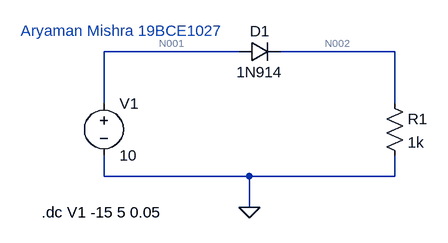
[diagram p0: schematic 2 Diode Characteristics.asc]
2 Diode Characteristics.asc, the LTspice schematic file:
Version 4
SHEET 1 880 680
WIRE 256 48 48 48
WIRE 496 48 320 48
WIRE 48 128 48 48
WIRE 496 128 496 48
WIRE 48 240 48 208
WIRE 272 240 48 240
WIRE 496 240 496 208
WIRE 496 240 272 240
WIRE 272 288 272 240
FLAG 272 288 0
SYMBOL voltage 48 112 R0
WINDOW 123 0 0 Left 0
WINDOW 39 0 0 Left 0
SYMATTR InstName V1
SYMATTR Value 10
SYMBOL diode 256 64 R270
WINDOW 0 32 32 VTop 2
WINDOW 3 0 32 VBottom 2
SYMATTR InstName D1
SYMATTR Value 1N914
SYMBOL res 480 112 R0
SYMATTR InstName R1
SYMATTR Value 1k
TEXT -48 296 Left 2 !.dc V1 -15 5 0.05
TEXT -80 16 Left 2 ;Aryaman Mishra 19BCE1027

The netlist it stands for:
* 2 Diode Characteristics.asc
V1 N001 0 10
D1 N001 N002 1N914
R1 N002 0 1k
.model D D
.lib standard.dio
.dc V1 -15 5 0.05
* Aryaman Mishra 19BCE1027
.backanno
.end

* Results of the author's LTspice run, read from the files saved beside the schematic
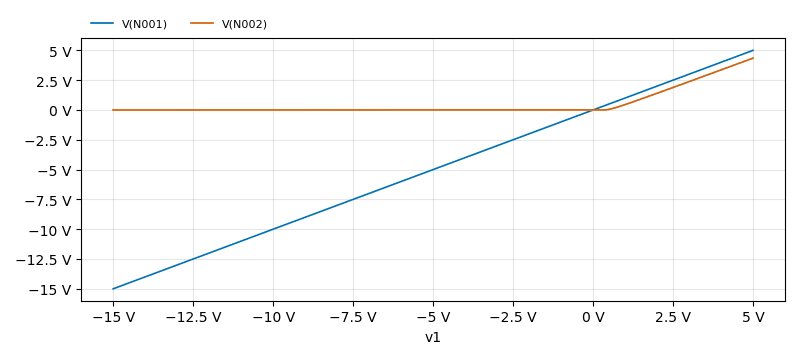
[diagram p1: DC transfer characteristic of 2 Diode Characteristics.asc, plotted from the saved traces]
* DC transfer characteristic, 1 run:
*   V(N001): -15 V at v1=-15 V, 5 V at v1=5 V, min -15 V, max 5 V
*   V(N002): -2.535 µV at v1=-15 V, 4.347 V at v1=5 V, min -2.535 µV, max 4.347 V